# Altium project Makit_Car_Kit.PrjPcb (part 1 of 3)
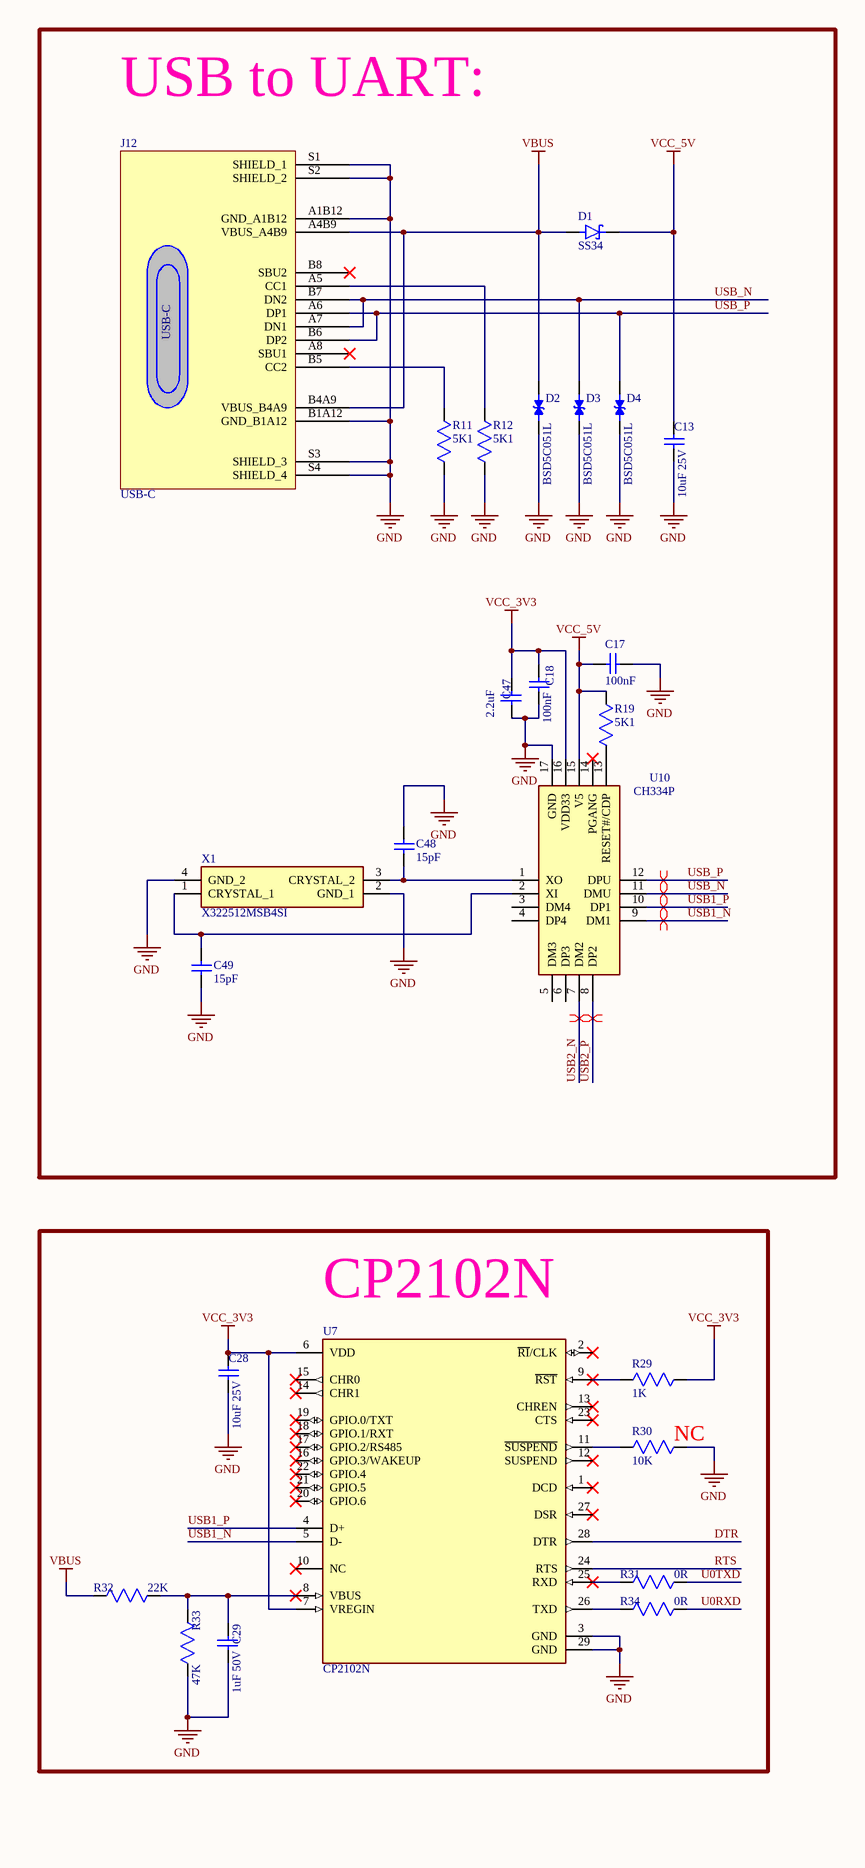
[diagram p0: Makit_Car_Kit.SchDoc, left]
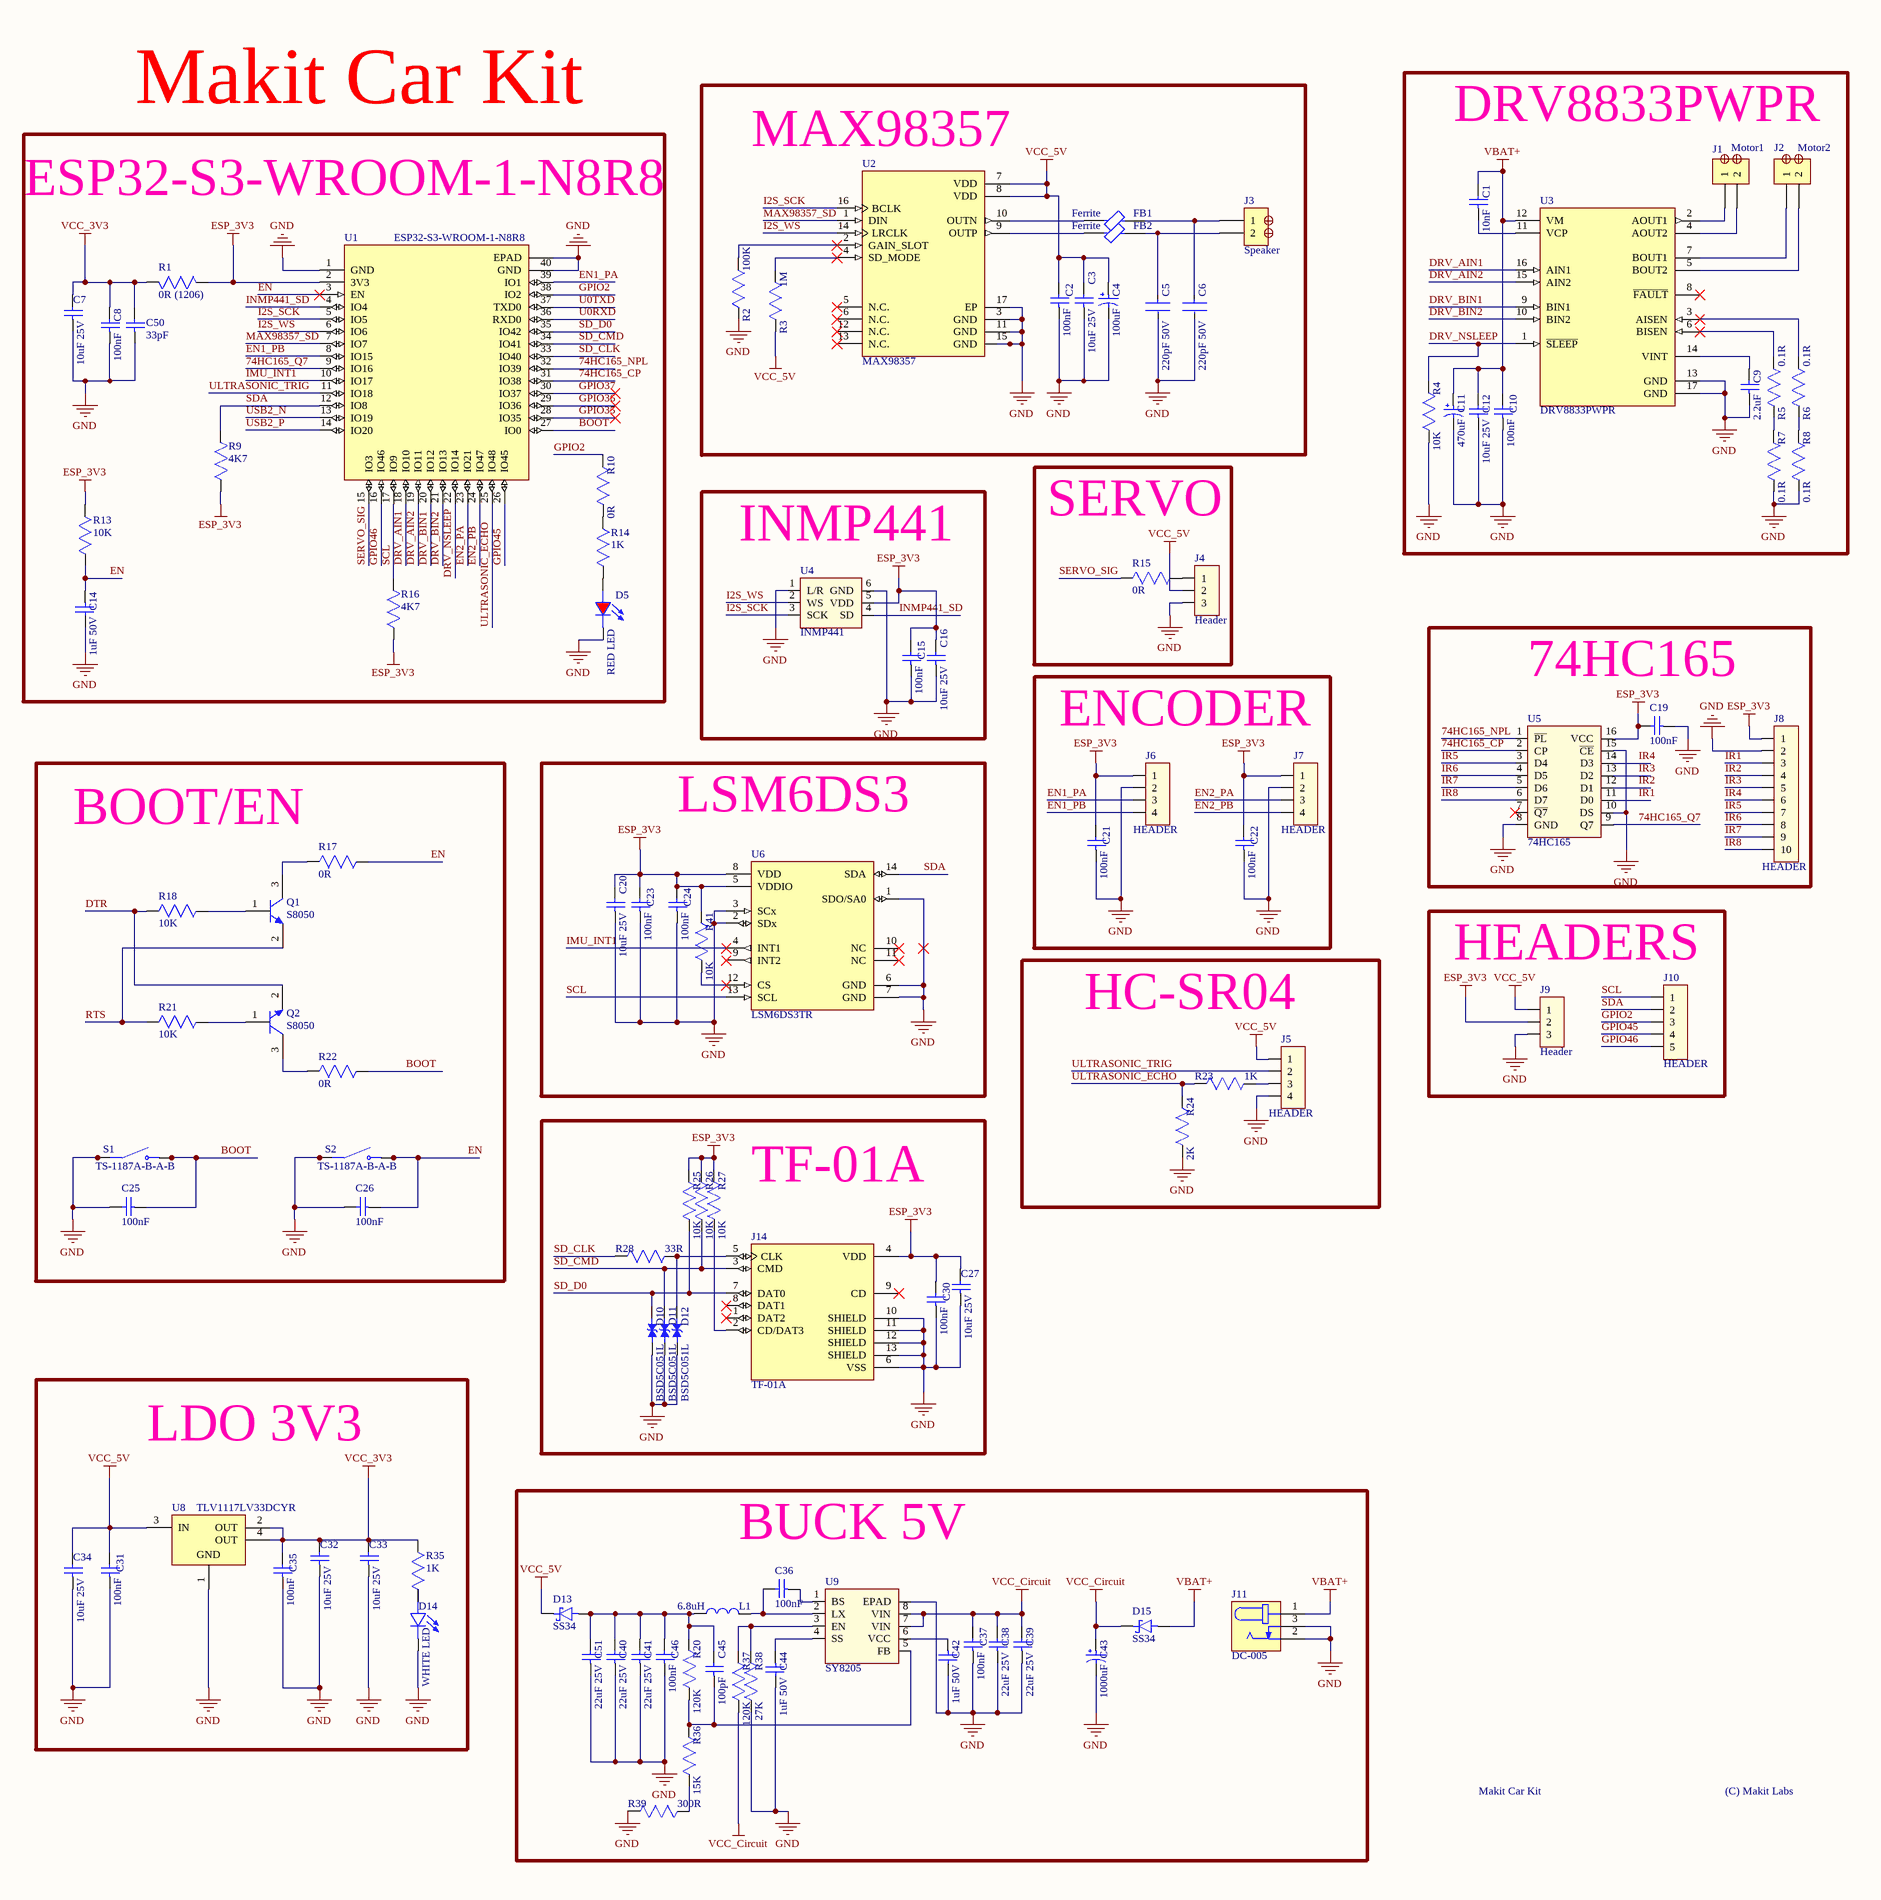
[diagram p1: Makit_Car_Kit.SchDoc, right]
1 sheet, 133 parts. Net scope: global (net labels, ports and power ports of the same name join across sheets).
Board file: Makit_Car_Kit PCB V1_1.PcbDoc

## Sheet Makit_Car_Kit.SchDoc
size A2; SheetNumber: 1; SheetTotal: 1

### Parts
C1  10nF  [CAP_0603]
C2  100nF  [CAP_0603]
C3  10uF 25V  [CAP_0603]
C4  100uF  [Cap_DD6.3xP2.5xL11]
C5  220pF 50V  [FP-CL10-IPC_A]
C6  220pF 50V  [FP-CL10-IPC_A]
C7  10uF 25V  [CAP_0603]
C8  100nF  [CAP_0603]
C9  2.2uF  [CAP_0603]
C10  100nF  [CAP_0603]
C11  470uF  [Cap_D10xP5xL16]
C12  10uF 25V  [CAP_0603]
C13  10uF 25V  [CAP_0603]
C14  1uF 50V  [CAP_0603]
C15  100nF  [CAP_0603]
C16  10uF 25V  [CAP_0603]
C17  100nF  [CAP_0603]
C18  100nF  [CAP_0603]
C19  100nF  [CAP_0603]
C20  10uF 25V  [CAP_0603]
C21  100nF  [CAP_0603]
C22  100nF  [CAP_0603]
C23  100nF  [CAP_0603]
C24  100nF  [CAP_0603]
C25  100nF  [CAP_0603]
C26  100nF  [CAP_0603]
C27  10uF 25V  [CAP_0603]
C28  10uF 25V  [CAP_0603]
C29  1uF 50V  [CAP_0603]
C30  100nF  [CAP_0603]
C31  100nF  [CAP_0603]
C32  10uF 25V  [CAP_0603]
C33  10uF 25V  [CAP_0603]
C34  10uF 25V  [CAP_0603]
C35  100nF  [CAP_0603]
C36  100nF  [CAP_0603]
C37  100nF  [CAP_0603]
C38  22uF 25V  [CAP_1206]
C39  22uF 25V  [CAP_1206]
C40  22uF 25V  [CAP_1206]
C41  22uF 25V  [CAP_1206]
C42  1uF 50V  [CAP_0603]
C43  1000uF  [Cap_D10xP5xL16]
C44  1uF 50V  [CAP_0603]
C45  100pF  [CAP_0603]
C46  100nF  [CAP_0603]
C47  2.2uF  [CAP_0603]
C48  15pF  [CAP_0603]
C49  15pF  [CAP_0603]
C50  33pF  [CAP_0603]
C51  22uF 25V  [CAP_1206]
D1  SS34  [SMA(DO-214AC) Schottky Diode]
D2  BSD5C051L  [TVS_SOD-523]
D3  BSD5C051L  [TVS_SOD-523]
D4  BSD5C051L  [TVS_SOD-523]
D5  RED LED  [LED_KT-0603R]
D10  BSD5C051L  [TVS_SOD-523]
D11  BSD5C051L  [TVS_SOD-523]
D12  BSD5C051L  [TVS_SOD-523]
D13  SS34  [SMA(DO-214AC) Schottky Diode]
D14  WHITE LED  [LED_KT-0603R]
D15  SS34  [SMA(DO-214AC) Schottky Diode]
FB1  Ferrite  [FP-BLM18-0_15-t0_8-IPC_A]
FB2  Ferrite  [FP-BLM18-0_15-t0_8-IPC_A]
J1  Motor1  [TE_282837-2]
J2  Motor2  [TE_282837-2]
J3  Speaker  [TE_282837-2]
J4  Header  [HEADER X3]
J5  HEADER  [HEADER X4]
J6  HEADER  [HEADER X4]
J7  HEADER  [HEADER X4]
J8  HEADER  [HEADER X10]
J9  Header  [HEADER X3]
J10  HEADER  [HEADER X5]
J11  DC-005  [XKB_DC-005-5A-2.0]
J12  USB-C  [CONN12_C-31-M-12_HRO]
J14  TF-01A  [TF-01A]
L1  6.8uH  [INDC7266X50N]
Q1  S8050  [SOT-23]
Q2  S8050  [SOT-23]
R1  0R (1206)  [RES_1206]
R2  100K  [RES_0603]
R3  1M  [RES_0603]
R4  10K  [RES_0603]
R5  0.1R  [RES_1206]
R6  0.1R  [RES_1206]
R7  0.1R  [RES_1206]
R8  0.1R  [RES_1206]
R9  4K7  [RES_0603]
R10  0R  [RES_0603]
R11  5K1  [RES_0603]
R12  5K1  [RES_0603]
R13  10K  [RES_0603]
R14  1K  [RES_0603]
R15  0R  [RES_0603]
R16  4K7  [RES_0603]
R17  0R  [RES_0603]
R18  10K  [RES_0603]
R19  5K1  [RES_0603]
R20  120K  [RES_0603]
R21  10K  [RES_0603]
R22  0R  [RES_0603]
R23  1K  [RES_0603]
R24  2K  [RES_0603]
R25  10K  [RES_0603]
R26  10K  [RES_0603]
R27  10K  [RES_0603]
R28  33R  [RES_0603]
R29  1K  [RES_0603]
R30  10K  [RES_0603]
R31  0R  [RES_0603]
R32  22K  [RES_0603]
R33  47K  [RES_0603]
R34  0R  [RES_0603]
R35  1K  [RES_0603]
R36  15K  [RES_0603]
R37  120K  [RES_0603]
R38  27K  [RES_0603]
R39  300R  [RES_0603]
R41  10K  [RES_0603]
S1  TS-1187A-B-A-B  [SW_TS-1187A-B-A-B]
S2  TS-1187A-B-A-B  [SW_TS-1187A-B-A-B]
U1  ESP32-S3-WROOM-1-N8R8  [XCVR_ESP32S3WROOM1N8R8]
U2  MAX98357  [QFN50P300X300X80-17N]
U3  DRV8833PWPR  [FP-PWP0016C-IPC_A]
U4  INMP441  [INMP441]
U5  74HC165  [TSSOP-16]
U6  LSM6DS3TR  [FP-LGA-14-DM00249496-MFG]
U7  CP2102N  [QFN50P500X500X80-29N-D]
U8  TLV1117LV33DCYR  [DCY0004A_N]
U9  SY8205  [SOIC-8-EP]
U10  CH334P  [QFN50P300X300X80-17N]
X1  X322512MSB4SI  [X322512MSB4SI]

### Blocks framed on the sheet
DRV8833PWPR: C1 C9-C12 J1 J2 R4-R8 U3
USB to UART:: C13 C17 C18 C47-C49 D1-D4 J12 R11 R12 R19 U10 X1
MAX98357: C2-C6 FB1 FB2 J3 R2 R3 U2
Makit Car Kit: C7 C8 C14 C50 D5 R1 R9 R10 R13 R14 R16 U1
SERVO: J4 R15
INMP441: C15 C16 U4
74HC165: C19 J8 U5
ENCODER: C21 C22 J6 J7
BOOT/EN: C25 C26 Q1 Q2 R17 R18 R21 R22 S1 S2
LSM6DS3: C20 C23 C24 R41 U6
HC-SR04: J5 R23 R24
HEADERS: J9 J10
TF-01A: C27 C30 D10-D12 J14 R25-R28
CP2102N: C28 C29 R29-R34 U7
LDO 3V3: C31-C35 D14 R35 U8
BUCK 5V: C36-C46 C51 D13 D15 J11 L1 R20 R36-R39 U9

### Nets
ESP_3V3: C15.2 C16.2 C19.2 C20.2 C21.2 C22.2 C23.2 C24.2 C27.2 C30.2 J6.1 J7.1 J8.1 J9.2 J14.4(VDD) R1.1 R9.1 R13.1 R16.1 R25.1 R26.1 R27.2 R41.2 U1.2(3V3) U4.5(VDD) U5.16(VCC) U6.5(VDDIO) U6.8(VDD)
GND: C2.1 C3.1 C4.2 C5.2 C6.2 C7.1 C8.1 C9.1 C10.1 C11.2 C12.1 C13.1 C14.2 C15.1 C16.1 C17.1 C18.1 C19.1 C20.1 C21.1 C22.1 C23.1 C24.1 C25.2 C26.2 C27.1 C28.1 C29.2 C30.1 C31.1 C32.1 C33.1 C34.1 C35.1 C37.1 C38.1 C39.1 C40.1 C41.1 C42.2 C43.2 C44.2 C46.1 C47.2 C48.2 C49.1 C50.1 C51.1 D2.1 D3.1 D4.1 D5.C D10.1 D11.1 D12.1 D14.C J4.3 J5.4 J6.2 J7.2 J8.2 J9.3 J11.2 J11.3 J12.A1B12(GND_A1B12) J12.B1A12(GND_B1A12) J12.S1(SHIELD_1) J12.S2(SHIELD_2) J12.S3(SHIELD_3) J12.S4(SHIELD_4) J14.6(VSS) J14.10(SHIELD) J14.11(SHIELD) J14.12(SHIELD) J14.13(SHIELD) R2.2 R4.1 R7.2 R8.2 R11.2 R12.2 R24.1 R30.2 R33.1 R38.1 R39.2 S1.A(COM) S1.B(COM) S2.A(COM) S2.B(COM) U1.1(GND) U1.40(GND) U1.41(EPAD) U2.3(GND) U2.11(GND) U2.15(GND) U2.17(EP) U3.13(GND) U3.17(GND) U4.1(L/R) U4.6(GND) U5.8(GND) U5.10(DS) U5.15(~{CE}) U6.1(SDO/SA0) U6.2(SDx) U6.3(SCx) U6.6(GND) U6.7(GND) U7.3(GND) U7.29(GND) U8.1(GND) U9.EPAD U10.17(GND) X1.2(GND_1) X1.4(GND_2)
VBAT+: C1.2 C10.2 C11.1 C12.2 D15.2(A) J11.1 U3.12(VM)
VBUS: D1.2(A) D2.2 J12.A4B9(VBUS_A4B9) J12.B4A9(VBUS_B4A9) R32.2
VCC_3V3: C7.2 C8.2 C18.2 C28.2 C32.2 C33.2 C35.2 C47.1 C50.2 R1.2 R29.2 R35.1 U7.6(VDD) U7.7(VREGIN) U8.2(OUT) U8.4(OUT) U10.16(VDD33)
VCC_5V: C2.2 C3.2 C4.1 C13.2 C17.2 C31.2 C34.2 D1.1(K) D13.1(K) J4.2 J5.1 J9.1 R3.2 R19.2 U2.7(VDD) U2.8(VDD) U8.3(IN) U10.15(V5)
VCC_Circuit: C37.2 C38.2 C39.2 C43.1 D15.1(K) R37.1 U9.7(VIN) U9.8(VIN)
74HC165_CP: U1.31(IO38) U5.2(CP)
74HC165_NPL: U1.32(IO39) U5.1(~{PL})
74HC165_Q7: U1.9(IO16) U5.9(Q7)
BOOT: C25.1 R22.2 S1.C(NO) S1.D(NO) U1.27(IO0)
DRV_AIN1: U1.18(IO10) U3.16(AIN1)
DRV_AIN2: U1.19(IO11) U3.15(AIN2)
DRV_BIN1: U1.20(IO12) U3.9(BIN1)
DRV_BIN2: U1.21(IO13) U3.10(BIN2)
DRV_NSLEEP: R4.2 U1.22(IO14) U3.1(~{SLEEP})
DTR: Q2.2(E) R18.1 U7.28(DTR)
EN: C14.1 C26.1 R13.2 R17.2 S2.C(NO) S2.D(NO) U1.3(EN)
EN1_PA: J6.3 U1.39(IO1)
EN1_PB: J6.4 U1.8(IO15)
EN2_PA: J7.3 U1.23(IO21)
EN2_PB: J7.4 U1.24(IO47)
GPIO2: J10.3 R10.1 U1.38(IO2)
GPIO35: U1.28(IO35)
GPIO36: U1.29(IO36)
GPIO37: U1.30(IO37)
GPIO45: J10.4 U1.26(IO45)
GPIO46: J10.5 U1.16(IO46)
I2S_SCK: U1.5(IO5) U2.16(BCLK) U4.3(SCK)
I2S_WS: U1.6(IO6) U2.14(LRCLK) U4.2(WS)
IMU_INT1: U1.10(IO17) U6.4(INT1)
INMP441_SD: U1.4(IO4) U4.4(SD)
IR1: J8.3 U5.11(D0)
IR2: J8.4 U5.12(D1)
IR3: J8.5 U5.13(D2)
IR4: J8.6 U5.14(D3)
IR5: J8.7 U5.3(D4)
IR6: J8.8 U5.4(D5)
IR7: J8.9 U5.5(D6)
IR8: J8.10 U5.6(D7)
MAX98357_SD: U1.7(IO7) U2.1(DIN)
RTS: Q1.2(E) R21.1 U7.24(RTS)
SCL: J10.1 R16.2 U1.17(IO9) U6.13(SCL)
SD_CLK: R28.1 U1.33(IO40)
SD_CMD: D11.2 J14.3(CMD) R26.2 U1.34(IO41)
SD_D0: D10.2 J14.7(DAT0) R25.2 U1.35(IO42)
SDA: J10.2 R9.2 U1.12(IO8) U6.14(SDA)
SERVO_SIG: R15.1 U1.15(IO3)
U0RXD: R34.2 U1.36(RXD0)
U0TXD: R31.2 U1.37(TXD0)
ULTRASONIC_ECHO: R23.1 R24.2 U1.25(IO48)
ULTRASONIC_TRIG: J5.2 U1.11(IO18)
USB1_N: U7.5(D-) U10.9(DM1)
USB1_P: U7.4(D+) U10.10(DP1)
USB2_N: U1.13(IO19) U10.7(DM2)
USB2_P: U1.14(IO20) U10.8(DP2)
USB_N: D3.2 J12.A7(DN1) J12.B7(DN2) U10.11(DMU)
USB_P: D4.2 J12.A6(DP1) J12.B6(DP2) U10.12(DPU)
NetC1_1: C1.1 U3.11(VCP)
NetC5_1: C5.1 FB2.2 J3.2
NetC6_1: C6.1 FB1.2 J3.1
NetC9_2: C9.2 U3.14(VINT)
NetC29_1: C29.1 R32.1 R33.2 U7.8(VBUS)
NetC36_1: C36.1 U9.1(BS)
NetC36_2: C36.2 L1.2 U9.2(LX)
NetC40_2: C40.2 C41.2 C45.2 C46.2 C51.2 D13.2(A) L1.1 R20.2
NetC42_1: C42.1 U9.6(VCC)
NetC44_1: C44.1 U9.4(SS)
NetC45_1: C45.1 R20.1 R36.1 U9.5(FB)
NetC48_1: C48.1 U10.1(XO) X1.3(CRYSTAL_2)
NetC49_2: C49.2 U10.2(XI) X1.1(CRYSTAL_1)
NetD5_A: D5.A R14.2
NetD12_2: D12.2 J14.5(CLK) R28.2
NetD14_A: D14.A R35.2
NetFB1_1: FB1.1 U2.10(OUTN)
NetFB2_1: FB2.1 U2.9(OUTP)
NetJ1_1: J1.1 U3.2(AOUT1)
NetJ1_2: J1.2 U3.4(AOUT2)
NetJ2_1: J2.1 U3.7(BOUT1)
NetJ2_2: J2.2 U3.5(BOUT2)
NetJ4_1: J4.1 R15.2
NetJ5_3: J5.3 R23.2
NetJ12_A5: J12.A5(CC1) R12.1
NetJ12_B5: J12.B5(CC2) R11.1
NetJ14_2: J14.2(CD/DAT3) R27.1
NetQ1_1: Q1.1(B) R18.2
NetQ1_3: Q1.3(C) R17.1
NetQ2_1: Q2.1(B) R21.2
NetQ2_3: Q2.3(C) R22.1
NetR2_1: R2.1 U2.2(GAIN_SLOT)
NetR3_1: R3.1 U2.4(SD_MODE)
NetR5_1: R5.1 U3.6(BISEN)
NetR5_2: R5.2 R7.1
NetR6_1: R6.1 U3.3(AISEN)
NetR6_2: R6.2 R8.1
NetR10_2: R10.2 R14.1
NetR19_1: R19.1 U10.13(RESET#/CDP)
NetR29_1: R29.1 U7.9(~{RST})
NetR30_1: R30.1 U7.11(~{SUSPEND})
NetR31_1: R31.1 U7.25(RXD)
NetR34_1: R34.1 U7.26(TXD)
NetR36_2: R36.2 R39.1
NetR37_2: R37.2 R38.2 U9.3(EN)
NetR41_1: R41.1 U6.12(CS)

Not connected (* = marked no-connect by the designer): J12 A8(SBU1)* B8(SBU2)*; J14 1(DAT2)* 8(DAT1)* 9(CD)*; U2 5(N.C.)* 6(N.C.)* 12(N.C.)* 13(N.C.)*; U3 8(~{FAULT})*; U5 7(~{Q7})*; U6 9(INT2)* 10(NC)* 11(NC)*; U7 1(DCD)* 2(~{RI}/CLK)* 10(NC)* 12(SUSPEND)* 13(CHREN)* 14(CHR1)* 15(CHR0)* 16(GPIO.3/WAKEUP)* 17(GPIO.2/RS485)* 18(GPIO.1/RXT)* 19(GPIO.0/TXT)* 20(GPIO.6)* 21(GPIO.5)* 22(GPIO.4)* 23(CTS)* 27(DSR)*; U10 3(DM4) 4(DP4) 5(DM3) 6(DP3) 14(PGANG)*

### Layout directives
differential pair; differential pair class DIFF90: USB1_N, USB1_P, USB2_N, USB2_P, USB_N, USB_P

### Notes on the sheet
- ESP32-S3-WROOM-1-N8R8
- (near R30) NC
- Makit Car Kit
- (C) Makit Labs